# Altium schematic sheet -LM1117.SchDoc
size A4
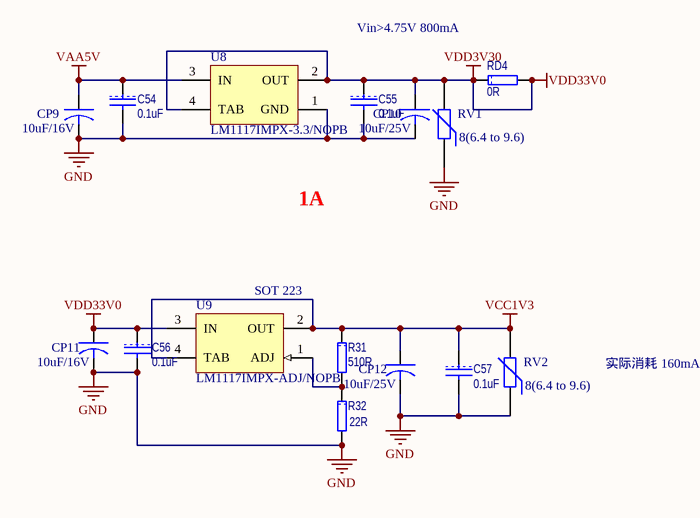
[diagram p0: -LM1117.SchDoc]

## Parts
C54  0.1uF  [1608[0603]]
C55  0.1uF  [1608[0603]]
C56  0.1uF  [1608[0603]]
C57  0.1uF  [1608[0603]]
CP9  10uF/16V  [3216[1206]]
CP10  10uF/25V  [6032]
CP11  10uF/16V  [3216[1206]]
CP12  10uF/25V  [6032]
R31  510R  [0603R]
R32  22R  [0603R]
RD4  0R
RV1  8(6.4 to 9.6)  [0603RV]
RV2  8(6.4 to 9.6)  [0603RV]
U8  LM1117IMPX-3.3/NOPB  [MP04A_N]
U9  LM1117IMPX-ADJ/NOPB  [MP04A_N]

## Nets
GND: C54.2 C55.2 C56.2 C57.2 CP9.2 CP10.2 CP11.2 CP12.2 R32.2 RV1.1 RV2.1 U8.1(GND)
VAA5V: C54.1 CP9.1 U8.3(IN)
VCC1V3: C57.1 CP12.1 R31.1 RV2.2 U9.2(OUT) U9.4(TAB)
VDD33V0: C55.1 C56.1 CP10.1 CP11.1 RD4.1 RD4.2 RV1.2 U8.2(OUT) U8.4(TAB) U9.3(IN)  [also labelled VDD3V30]
NetR31_2: R31.2 R32.1 U9.1(ADJ)

## Notes on the sheet
- Vin>4.75V 800mA
- 1A
- (near U9) SOT 223
- 实际消耗 160mA

## Library data of the parts
C54-C57 = CAP: Capacitor; Manufacturer: TDK; Type: 无铅电容; Model: C0603X7R1H104K; Value: 0.1uF
CP9-CP12 = CAPACITOR: Tantalum Capacitor; Compy: TAJ; name: TAJ-A-106-M-010-R
R31 = RES: Manufacturer: vishay; Model: RT0603DRD7D510RL; Value: 510R; Type: 无铅电阻
R32 = RES: Manufacturer: vishay; Model: CRCW060322R0KKEDTR; Value: 22R; Type: 无铅电阻
RD4 = RES: Manufacturer: vishay; Model: RT0603DRD7D0RL; Value: 0R; Type: 无铅电阻
RV1 RV2 = Res Varistor: 压敏电阻; Manufacture: TDK; Value: AVR-M1608C080MAAB; Published: 24-Mar-1999; LatestRevisionDate: 29-May-2009; LatestRevisionNote: IPC-7351 Footprint Added.; PackageVersion: Mar-2003; PackageReference: 6-0805; Publisher: Altium Limited; PackageDescription: Chip Resistor 0805 Case Size; Code_IPC: RESC2012
U8 = LM1117MPX-3.3/NOPB: 800mA Low-Dropout Linear Regulator, 4-pin SOT-223, Pb-Free; Manufacturer: National Semiconductor; PackageTopMarking: XYTT*N05A; PowerWise: N; CompType: LDO IC; Published: 1-Mar-2010; DatasheetVersion: Apr-2006; PackageVersion: revB, Apr-2003; PackageReference: MP04A; Publisher: Altium Limited; PackageDescription: Molded SOT-223, 6.50 x 3.56 x 1.6mm Body, 4 Lead, 2.3mm Pitch; Supplier 1: Digi-Key; Supplier Part Number 1: LM1117MPX-3.3TR-ND; Supplier 2: Digi-Key; Supplier Part Number 2: LM1117MPX-3.3CT-ND; Supplier 3: Digi-Key; Supplier Part Number 3: LM1117MPX-3.3DKR-ND; PartNumber: LM1117MPX-3.3/NOPB; RoHS: Y; PinCount: 4; Code_JEDEC: TO-261-AA; Code_IPC: SOT223-4; ComponentLink1Description: LM1117 Datasheet; ComponentLink1URL: http://www.national.com/ds/LM/LM1117.pdf; ComponentLink2Description: LM1117 Web Page; ComponentLink2URL: http://www.national.com/pf/LM/LM1117.html; ComponentLink3Description: MP04A Package Page; ComponentLink3URL: http://www.national.com/packaging/folders/mp04a.html
U9 = LM1117MPX-ADJ/NOPB: 800mA Low-Dropout Linear Regulator, 4-pin SOT-223, Pb-Free; Manufacturer: National Semiconductor; PackageTopMarking: XYTT*N03A; PowerWise: N; CompType: LDO IC; Published: 1-Mar-2010; DatasheetVersion: Apr-2006; PackageVersion: revB, Apr-2003; PackageReference: MP04A; Publisher: Altium Limited; PackageDescription: Molded SOT-223, 6.50 x 3.56 x 1.6mm Body, 4 Lead, 2.3mm Pitch; Supplier 1: Digi-Key; Supplier Part Number 1: LM1117MPX-ADJ-ND; PartNumber: LM1117MPX-ADJ/NOPB; RoHS: Y; PinCount: 4; Code_JEDEC: TO-261-AA; Code_IPC: SOT223-4; ComponentLink1Description: LM1117 Datasheet; ComponentLink1URL: http://www.national.com/ds/LM/LM1117.pdf; ComponentLink2Description: LM1117 Web Page; ComponentLink2URL: http://www.national.com/pf/LM/LM1117.html; ComponentLink3Description: MP04A Package Page; ComponentLink3URL: http://www.national.com/packaging/folders/mp04a.html